# Altium schematic sheet VCU_Schematic.SchDoc
size A3; SheetNumber: 1; SheetTotal: 1
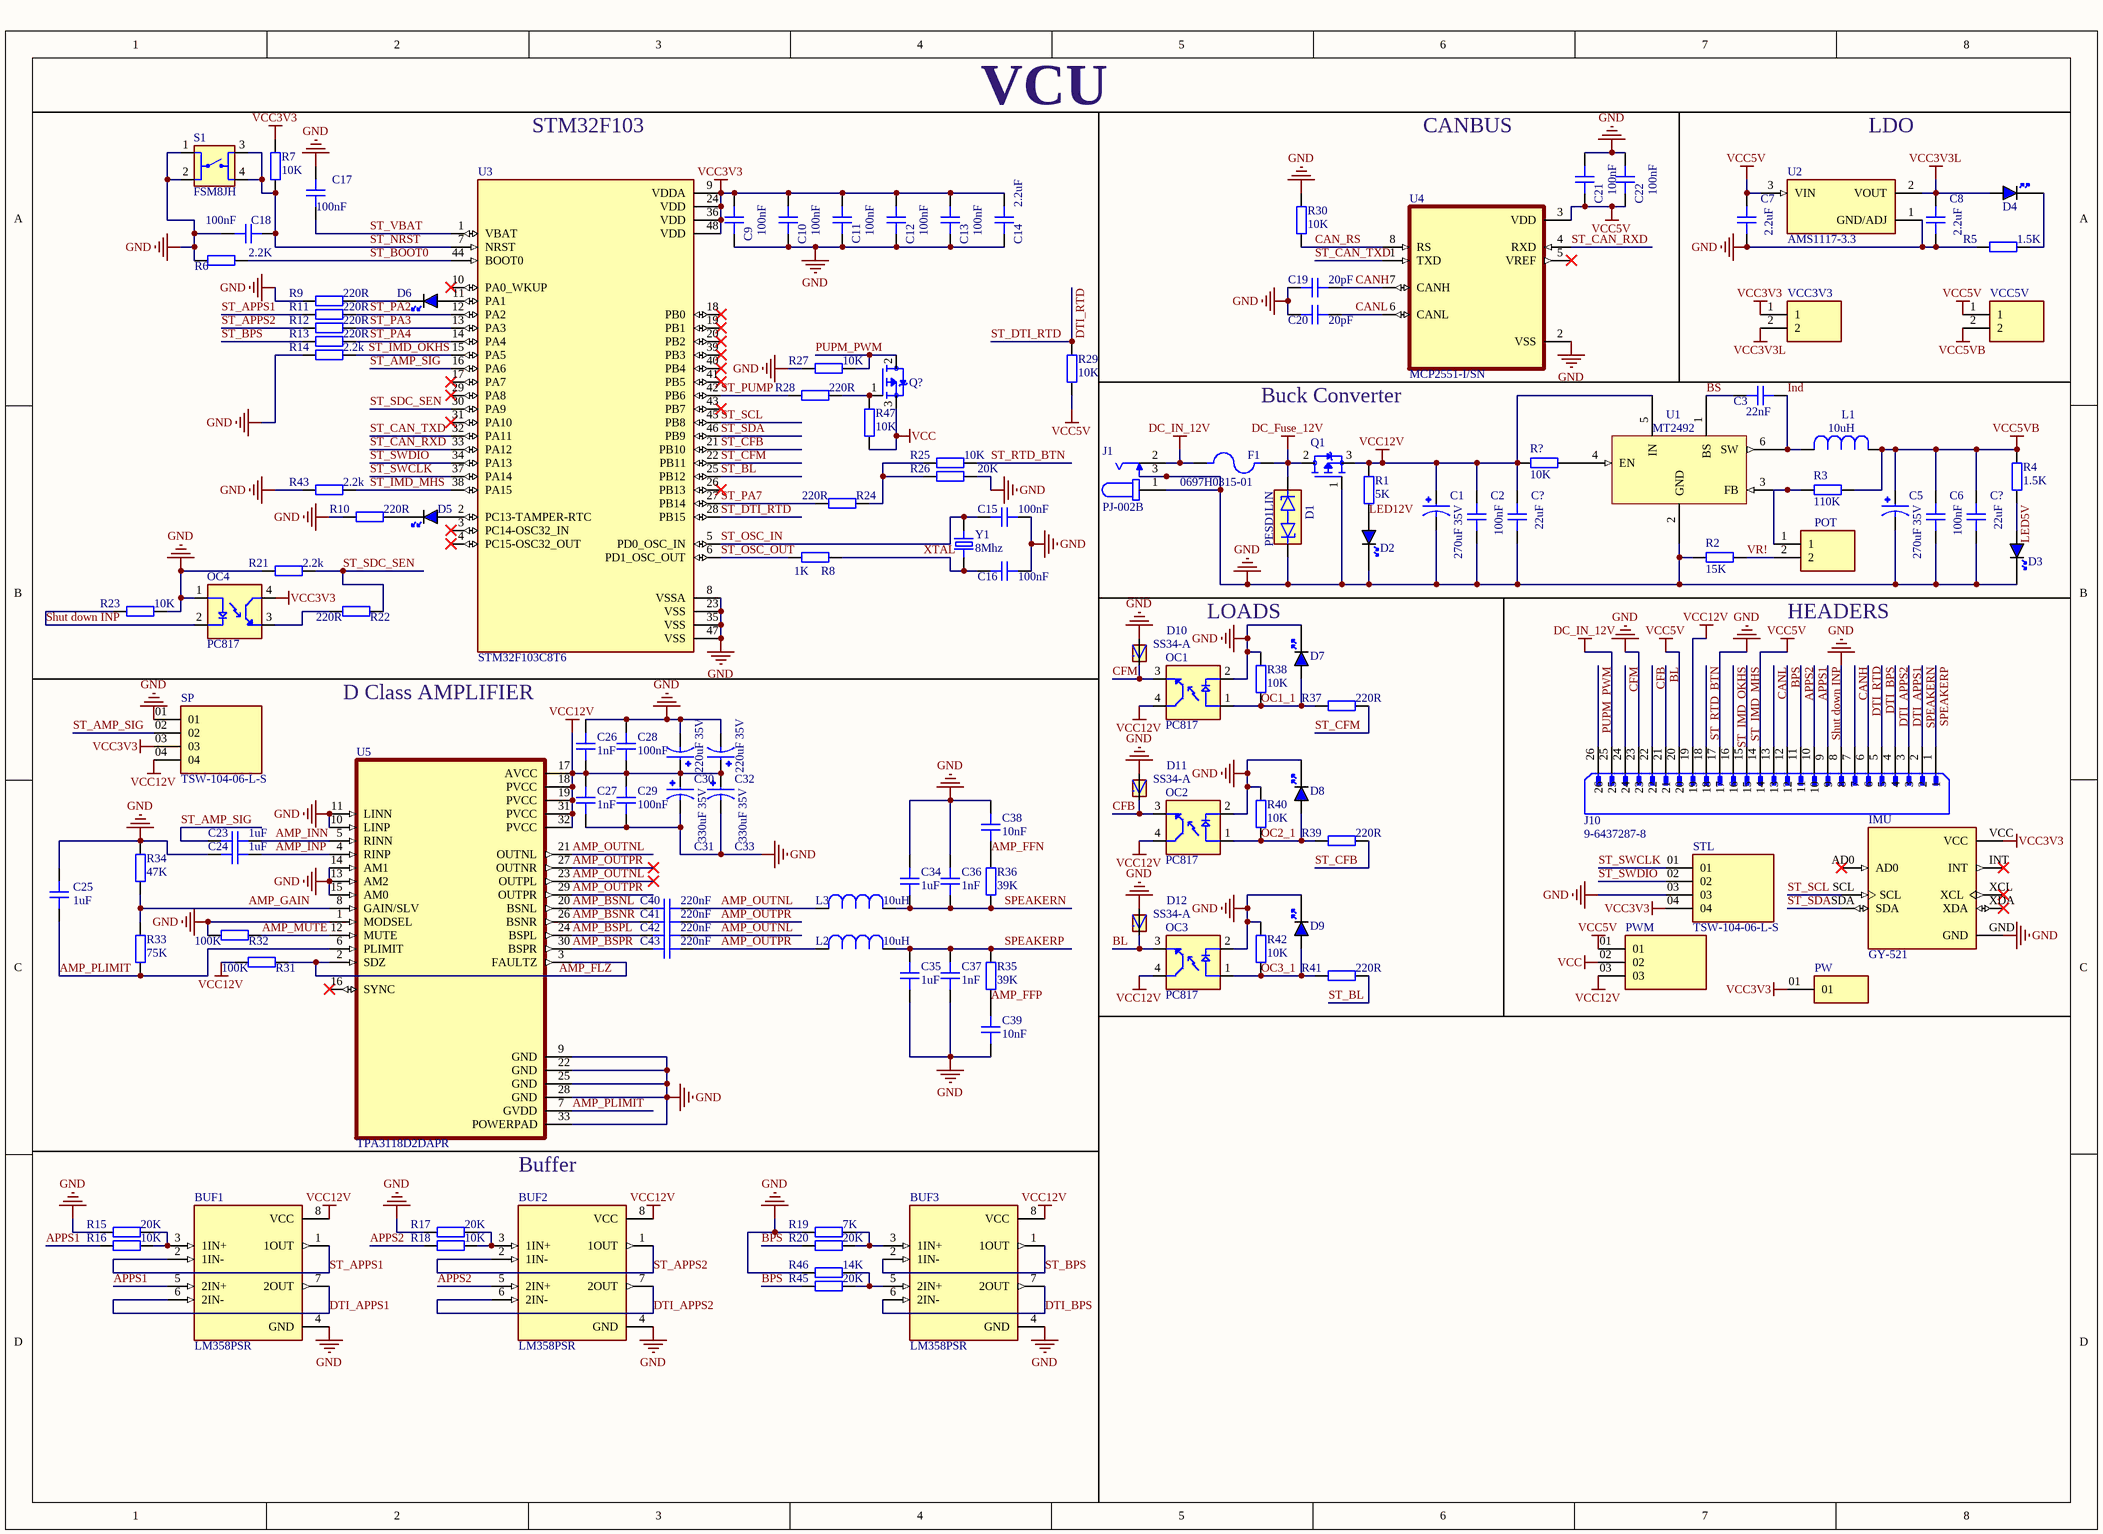
[diagram p0: VCU_Schematic.SchDoc]

## Parts
(Parts that share a designator on the sheet are numbered #1, #2 ... from top to bottom, then left to right.)
BUF1  LM358PSR  [SOIC127P780X200-8N]
BUF2  LM358PSR  [SOIC127P780X200-8N]
BUF3  LM358PSR  [SOIC127P780X200-8N]
C1  270uF 35V  [CAP_EEEFT1E471AP]
C2  100nF  [CAP_0805]
C3  22nF  [CAP_0805]
C5  270uF 35V  [CAP_EEEFT1E471AP]
C6  100nF  [CAP_0805]
C7  2.2uF  [CAP_0805]
C8  2.2uF  [CAP_0805]
C9  100nF  [CAP_0805]
C10  100nF  [CAP_0805]
C11  100nF  [CAP_0805]
C12  100nF  [CAP_0805]
C13  100nF  [CAP_0805]
C14  2.2uF  [CAP_0805]
C15  100nF  [CAP_0805]
C16  100nF  [CAP_0805]
C17  100nF  [CAP_0805]
C18  100nF  [CAP_0805]
C19  20pF  [CAP_0805]
C20  20pF  [CAP_0805]
C21  100nF  [CAP_0805]
C22  100nF  [CAP_0805]
C23  1uF  [CAP_0805]
C24  1uF  [CAP_0805]
C25  1uF  [CAP_0805]
C26  1nF  [CAP_0805]
C27  1nF  [CAP_0805]
C28  100nF  [CAP_0805]
C29  100nF  [CAP_0805]
C30  220uF 35V  [CAP_EEEFT1E471AP]
C31  330uF 35V  [CAP_EEEFT1E471AP]
C32  220uF 35V  [CAP_EEEFT1E471AP]
C33  330uF 35V  [CAP_EEEFT1E471AP]
C34  1uF  [CAP_0805]
C35  1uF  [CAP_0805]
C36  1nF  [CAP_0805]
C37  1nF  [CAP_0805]
C38  10nF  [CAP_0805]
C39  10nF  [CAP_0805]
C40  220nF  [CAP_0805]
C41  220nF  [CAP_0805]
C42  220nF  [CAP_0805]
C43  220nF  [CAP_0805]
C?#1  22uF  [CAP_0805]
C?#2  22uF  [CAP_0805]
D1  PESD1LIN  [DIO_PESD1LIN]
D2  BLUE  [LED_0805_BLUE]  (value not drawn)
D3  BLUE  [LED_0805_BLUE]  (value not drawn)
D4  BLUE  [LED_0805_BLUE]  (value not drawn)
D5  BLUE  [LED_0805_BLUE]  (value not drawn)
D6  BLUE  [LED_0805_BLUE]  (value not drawn)
D7  BLUE  [LED_0805_BLUE]  (value not drawn)
D8  BLUE  [LED_0805_BLUE]  (value not drawn)
D9  BLUE  [LED_0805_BLUE]  (value not drawn)
D10  SS34-A  [DO-214AC]
D11  SS34-A  [DO-214AC]
D12  SS34-A  [DO-214AC]
F1  0697H0315-01  [FUSRR508W60L835T400H810]
IMU  GY-521  [MODULE_GY-521]
J1  PJ-002B  [CUI_PJ-002B]
J10  9-6437287-8  [TE_9-6437287-8]
L1  10uH  [IND_CDRH127/LDNP-470MC_SUM]
L2  10uH  [IND_CDRH127/LDNP-470MC_SUM]
L3  10uH  [IND_CDRH127/LDNP-470MC_SUM]
OC1  PC817  [SOIC254P960X420-4N]
OC2  PC817  [SOIC254P960X420-4N]
OC3  PC817  [SOIC254P960X420-4N]
OC4  PC817  [SOIC254P960X420-4N]
POT  3-644456-2  [TE_3-644456-2]  (value not drawn)
PW  HMTSW-101-X-X-S-X  [SAMTEC_HMTSW-101-X-X-S-X]  (value not drawn)
PWM  TLW-103-05-G-S  [SAMTEC_TLW-103-05-G-S]  (value not drawn)
Q1  IRF4905STRRPBF  [TRANS_IRF4905STRRPBF]  (value not drawn)
Q?  IRF4905STRRPBF  [TRANS_IRF4905STRRPBF]  (value not drawn)
R1  5K  [RES_0805]
R2  15K  [RES_0805]
R3  110K  [RES_0805]
R4  1.5K  [RES_0805]
R5  1.5K  [RES_0805]
R6  2.2K  [RES_0805]
R7  10K  [RES_0805]
R8  1K  [RES_0805]
R9  220R  [RES_0805]
R10  220R  [RES_0805]
R11  220R  [RES_0805]
R12  220R  [RES_0805]
R13  220R  [RES_0805]
R14  2.2k  [RES_0805]
R15  20K  [RES_0805]
R16  10K  [RES_0805]
R17  20K  [RES_0805]
R18  10K  [RES_0805]
R19  7K  [RES_0805]
R20  20K  [RES_0805]
R21  2.2k  [RES_0805]
R22  220R  [RES_0805]
R23  10K  [RES_0805]
R24  220R  [RES_0805]
R25  10K  [RES_0805]
R26  20K  [RES_0805]
R27  10K  [RES_0805]
R28  220R  [RES_0805]
R29  10K  [RES_0805]
R30  10K  [RES_0805]
R31  100K  [RES_0805]
R32  100K  [RES_0805]
R33  75K  [RES_0805]
R34  47K  [RES_0805]
R35  39K  [RES_0805]
R36  39K  [RES_0805]
R37  220R  [RES_0805]
R38  10K  [RES_0805]
R39  220R  [RES_0805]
R40  10K  [RES_0805]
R41  220R  [RES_0805]
R42  10K  [RES_0805]
R43  2.2k  [RES_0805]
R45  20K  [RES_0805]
R46  14K  [RES_0805]
R47  10K  [RES_0805]
R?  10K  [RES_0805]
S1  FSM8JH  [SW_FSM8JH]
SP  TSW-104-06-L-S  [SAMTEC_TSW-104-06-L-S]
STL  TSW-104-06-L-S  [SAMTEC_TSW-104-06-L-S]
U1  MT2492  [PCBComponent_1 - duplicate]
U2  AMS1117-3.3  [SOT229P700X180-4N]
U3  STM32F103C8T6  [QFP50P900X900X160-48N]
U4  MCP2551-I/SN  [SOIC127P599X175-8N]
U5  TPA3118D2DAPR  [SOP65P810X120-33N]
VCC3V3  3-644456-2  [TE_3-644456-2]  (value not drawn)
VCC5V  3-644456-2  [TE_3-644456-2]  (value not drawn)
Y1  8Mhz  [XTAL_ECS-80-20-5PVX]

## Nets
DC_Fuse_12V: D1.2 F1.2 Q1.2(D)
DC_IN_12V: F1.1 J1.2 J10.25
GND: BUF1.4(GND) BUF2.4(GND) BUF3.4(GND) C1.2 C2.2 C5.2 C6.2 C7.2 C8.2 C9.1 C10.1 C11.1 C12.1 C13.1 C14.2 C15.1 C16.1 C17.1 C18.2 C19.2 C20.2 C21.2 C22.2 C24.1 C25.2 C26.2 C27.1 C28.2 C29.1 C30.2 C31.2 C32.2 C33.2 C34.2 C35.2 C36.2 C37.2 C38.2 C39.2 C?#1.2 C?#2.2 D1.1 D2.K D3.K D7.K D8.K D9.K D10.A D11.A D12.A IMU.GND J1.1 J1.3 J10.8 J10.17 J10.23 OC1.2(C) OC2.2(C) OC3.2(C) OC4.1(A) Q1.1(G) R2.1 R5.2 R6.1 R9.2 R10.2 R14.2 R15.2 R17.2 R19.2 R21.2 R23.2 R26.2 R27.1 R30.2 R32.1 R34.2 R38.2 R40.2 R42.2 R43.2 R46.2 S1.1 S1.2 SP.01 STL.03 U1.2(GND) U2.1(GND/ADJ) U3.8(VSSA) U3.23(VSS) U3.35(VSS) U3.47(VSS) U4.2(VSS) U5.1(MODSEL) U5.9(GND) U5.10(LINP) U5.11(LINN) U5.13(AM2) U5.14(AM1) U5.15(AM0) U5.22(GND) U5.25(GND) U5.28(GND) U5.33(POWERPAD)
VCC: PWM.02 Q?.3(S) R47.2
VCC3V3: C9.2 C10.2 C11.2 C12.2 C13.2 C14.1 IMU.VCC OC4.4(CT) PW.01 R7.2 SP.03 STL.04 U3.9(VDDA) U3.24(VDD) U3.36(VDD) U3.48(VDD) VCC3V3.1
VCC3V3L: C8.1 D4.A U2.2(VOUT) VCC3V3.2
VCC5V: C7.1 C21.1 C22.1 J10.14 J10.20 PWM.01 R29.2 U2.3(VIN) U4.3(VDD) VCC5V.1
VCC5VB: C5.1 C6.1 C?#2.1 L1.1 R3.2 R4.2 VCC5V.2
VCC12V: BUF1.8(VCC) BUF2.8(VCC) BUF3.8(VCC) C1.1 C2.1 C26.1 C27.2 C28.1 C29.2 C30.1 C31.1 C32.1 C33.1 C?#1.1 J10.19 OC1.4(CT) OC2.4(CT) OC3.4(CT) PWM.03 Q1.3(S) R1.2 R31.1 R?.2 SP.04 U1.5(IN) U5.17(AVCC) U5.18(PVCC) U5.19(PVCC) U5.31(PVCC) U5.32(PVCC)
AMP_BSNL: C40.2 U5.20(BSNL)
AMP_BSNR: C41.2 U5.26(BSNR)
AMP_BSPL: C42.2 U5.24(BSPL)
AMP_BSPR: C43.2 U5.30(BSPR)
AMP_FFN: C38.1 R36.2
AMP_FFP: C39.1 R35.2
AMP_FLZ: R31.2 U5.2(SDZ) U5.3(FAULTZ)
AMP_GAIN: R33.2 R34.1 U5.8(GAIN/SLV)
AMP_INN: C23.2 U5.5(RINN)
AMP_INP: C24.2 U5.4(RINP)
AMP_MUTE: R32.2 U5.12(MUTE)
AMP_OUTNL: C40.1 C42.1 L3.2 U5.21(OUTNL) U5.23(OUTPL)
AMP_OUTPR: C41.1 C43.1 L2.2 U5.27(OUTNR) U5.29(OUTPR)
AMP_PLIMIT: C25.1 R33.1 U5.6(PLIMIT) U5.7(GVDD)
APPS1: BUF1.5(2IN+) J10.10 R16.2
APPS2: BUF2.5(2IN+) J10.11 R18.2
BL: D12.C J10.21 OC3.3(ET)
BPS: J10.12 R20.2 R45.2
BS: C3.1 U1.1(BS)
CAN_RS: R30.1 U4.8(RS)
CANH: C19.1 J10.7 U4.7(CANH)
CANL: C20.1 J10.13 U4.6(CANL)
CFB: D11.C J10.22 OC2.3(ET)
CFM: D10.C J10.24 OC1.3(ET)
DTI_APPS1: BUF1.6(2IN-) BUF1.7(2OUT) J10.3
DTI_APPS2: BUF2.6(2IN-) BUF2.7(2OUT) J10.4
DTI_BPS: BUF3.6(2IN-) BUF3.7(2OUT) J10.5
DTI_RTD: J10.6 R29.1 U3.28(PB15)  [also labelled ST_DTI_RTD]
Ind: C3.2 L1.2 U1.6(SW)
LED5V: D3.A R4.1
LED12V: D2.A R1.1
OC1_1: D7.A OC1.1(A) R37.2 R38.1
OC2_1: D8.A OC2.1(A) R39.2 R40.1
OC3_1: D9.A OC3.1(A) R41.2 R42.1
PUPM_PWM: J10.26 Q?.2(D) R27.2
Shut down INP: J10.9 OC4.2(C) R23.1
SPEAKERN: C34.1 C36.1 J10.2 L3.1 R36.1
SPEAKERP: C35.1 C37.1 J10.1 L2.1 R35.1
ST_AMP_SIG: C23.1 SP.02 U3.16(PA6)
ST_APPS1: BUF1.1(1OUT) BUF1.2(1IN-) R11.2
ST_APPS2: BUF2.1(1OUT) BUF2.2(1IN-) R12.2
ST_BL: R41.1 U3.25(PB12)
ST_BOOT0: R6.2 U3.44(BOOT0)
ST_BPS: BUF3.1(1OUT) BUF3.2(1IN-) R13.2
ST_CAN_RXD: U3.33(PA12) U4.4(RXD)
ST_CAN_TXD: U3.32(PA11) U4.1(TXD)
ST_CFB: R39.1 U3.21(PB10)
ST_CFM: R37.1 U3.22(PB11)
ST_IMD_MHS: J10.15 R43.1 U3.38(PA15)
ST_IMD_OKHS: J10.16 R14.1 U3.15(PA5)
ST_NRST: C18.1 R7.1 S1.3 S1.4 U3.7(NRST)
ST_OSC_IN: C15.2 U3.5(PD0_OSC_IN) Y1.2
ST_OSC_OUT: R8.1 U3.6(PD1_OSC_OUT)
ST_PA2: R11.1 U3.12(PA2)
ST_PA3: R12.1 U3.13(PA3)
ST_PA4: R13.1 U3.14(PA4)
ST_PA7: R24.1 U3.27(PB14)
ST_PUMP: R28.1 U3.42(PB6)
ST_RTD_BTN: J10.18 R25.2
ST_SCL: IMU.SCL U3.45(PB8)
ST_SDA: IMU.SDA U3.46(PB9)
ST_SDC_SEN: R21.1 R22.2 U3.30(PA9)
ST_SWCLK: STL.01 U3.37(PA14)
ST_SWDIO: STL.02 U3.34(PA13)
ST_VBAT: C17.2 U3.1(VBAT)
VR!: POT.2 R2.2
XTAL: C16.2 R8.2 Y1.1
NetBUF1_3: BUF1.3(1IN+) R15.1 R16.1
NetBUF2_3: BUF2.3(1IN+) R17.1 R18.1
NetBUF3_3: BUF3.3(1IN+) R19.1 R20.1
NetBUF3_5: BUF3.5(2IN+) R45.1 R46.1
NetD4_K: D4.K R5.1
NetD5_A: D5.A U3.2(PC13-TAMPER-RTC)
NetD5_K: D5.K R10.1
NetD6_A: D6.A U3.11(PA1)
NetD6_K: D6.K R9.1
NetOC4_3: OC4.3(ET) R22.1
NetPOT_1: POT.1 R3.1 U1.3(FB)
NetQ?_1: Q?.1(G) R28.2 R47.1
NetR24_2: R24.2 R25.1 R26.1
NetR?_1: R?.1 U1.4(EN)

Not connected (* = marked no-connect by the designer): IMU AD0* INT* XCL* XDA*; U3 3(PC14-OSC32_IN)* 4(PC15-OSC32_OUT)* 10(PA0_WKUP)* 17(PA7)* 18(PB0)* 19(PB1)* 20(PB2)* 26(PB13)* 29(PA8)* 31(PA10)* 39(PB3)* 40(PB4)* 41(PB5)* 43(PB7)*; U4 5(VREF)*; U5 16(SYNC)*

## Notes on the sheet
- STM32F103
- VCU
- CANBUS
- LDO
- Buck Converter
- LOADS
- (near POT) HEADERS
- D Class AMPLIFIER
- Buffer

## Library data of the parts
BUF1-BUF3 = LM358PSR: Dual, 30-V, 700-kHz operational amplifier; MF: Texas Instruments; SnapEDA_Link: https://www.snapeda.com/parts/LM358PSR/Texas+Instruments/view-part/?ref=snap; Package: SOP-8 Texas Instruments; Value: *; MP: LM358PSR; Check_prices: https://www.snapeda.com/parts/LM358PSR/Texas+Instruments/view-part/?ref=eda
C1 C5 C30-C33 = EEEFT1E471AP: Cap Aluminum Lytic 470uF 25V 20% (8 X 10.2mm) SMD 0.08 Ohm 850mA 2000h 105C Automotive T/R; MF: Panasonic; SnapEDA_Link: https://www.snapeda.com/parts/EEEFT1E471AP/Panasonic/view-part/?ref=snap; Package: RADIAL-2 Panasonic; Value: *; MP: EEEFT1E471AP; Check_prices: https://www.snapeda.com/parts/EEEFT1E471AP/Panasonic/view-part/?ref=eda
C2 C3 C6-C29 C34-C43 C?#1 C?#2 = CAP_0805: Capacitor SMD 0805; Manufacturer: *; Manufacturer Part Number: *; Distributor Link: *; LCSC: *; Rating: *; Dielectric: *
D1 = PESD1LIN: 44V, 70V Clamp 3A (8/20Âµs) Ipp Tvs Diode Surface Mount SOD-323; MF: Nexperia USA; SnapEDA_Link: https://www.snapeda.com/parts/PESD1LIN/Nexperia/view-part/?ref=snap; Package: SOD-323 Vishay Semiconductor Diodes Division; Value: *; MP: PESD1LIN; Check_prices: https://www.snapeda.com/parts/PESD1LIN/Nexperia/view-part/?ref=eda
D2-D9 = LED_0805_BLUE: LED 0805 BLUE SMD; Manufacturer: *; Manufacturer Part Number: *; Distributor Link: *; LCSC: *
D10-D12 = SS34-A: Schottky barrier diode, 3A, 40V; MF: hy electronic corp; MP: SS34A; SnapEDA_Link: https://www.snapeda.com/parts/SS34A/HY+Electronic/view-part/?ref=snap; Package: None; Value: *; Check_prices: https://www.snapeda.com/parts/SS34A/HY+Electronic/view-part/?ref=eda
F1 = 0697H0315-01: 2-Pin Radial Fuse | Rectangular | Slow Blow | UL | 315mA; MF: Bel Fuse; SnapEDA_Link: https://www.snapeda.com/parts/0697H0315-01/Bel+Circuit+Protection/view-part/?ref=snap; Package: Radial Box  Bel Fuse; Value: *; MP: 0697H0315-01; Check_prices: https://www.snapeda.com/parts/0697H0315-01/Bel+Circuit+Protection/view-part/?ref=eda
IMU = GY-521: Triple Axis Accelerometer Gyro Breakout; MF: GODREAM FORDREAM CO., LIMITED; SnapEDA_Link: https://www.snapeda.com/parts/GY-521/GODREAM+FORDREAM+CO.%252C+LIMITED/view-part/?ref=snap; Package: Package; Value: *; MP: GY-521; Check_prices: https://www.snapeda.com/parts/GY-521/GODREAM+FORDREAM+CO.%252C+LIMITED/view-part/?ref=eda
J1 = PJ-002B: 2.5 x 6.5 mm, 2.5 A, Horizontal, Through Hole, Dc Power Jack Connector; MF: Same Sky; SnapEDA_Link: https://www.snapeda.com/parts/PJ-002B/Same+Sky/view-part/?ref=snap; Package: None; Value: *; MP: PJ-002B; Check_prices: https://www.snapeda.com/parts/PJ-002B/Same+Sky/view-part/?ref=eda
J10 = 9-6437287-8: MF: {'manufacturer': 'TE Connectivity'}; Package: None; Value: *; Availability: Unavailable; MP: 9-6437287-8; Price: None
L1-L3 = CDRH127/LDNP-470MC: Inductor Power Shielded Drum Core 47uH 20% 1KHz Ferrite 4.1A 0.078Ohm DCR T/R; MF: Sumida Corporation; SnapEDA_Link: https://www.snapeda.com/parts/CDRH127/LDNP-470MC/Sumida/view-part/?ref=snap; Package: Non Standard Sumida; Value: *; MP: CDRH127/LDNP-470MC; Check_prices: https://www.snapeda.com/parts/CDRH127/LDNP-470MC/Sumida/view-part/?ref=eda
OC1-OC4 = PC817X1NIP1B: Optoisolator Transistor Output 1 Channel 4-SMD; MF: Sharp Microelectronics; SnapEDA_Link: https://www.snapeda.com/parts/PC817X1NIP1B/Sharp+Microelectronics/view-part/?ref=snap; Package: None; Value: *; MP: PC817X1NIP1B; Check_prices: https://www.snapeda.com/parts/PC817X1NIP1B/Sharp+Microelectronics/view-part/?ref=eda
POT VCC3V3 VCC5V = 3-644456-2: HEADER ASSEMBLY, NARROW, MTA-100, 2 POSITION, STRAIGHT | TE Connectivity 3-644456-2; SnapEDA_Link: https://www.snapeda.com/parts/3-644456-2/TE+Connectivity+AMP+Connectors/view-part/?ref=snap; Package: None; Value: *; MF: TE Connectivity; MP: 3-644456-2; Check_prices: https://www.snapeda.com/parts/3-644456-2/TE+Connectivity+AMP+Connectors/view-part/?ref=eda
PW = HMTSW-101-X-X-S-X: CONN HEADER VERT 1POS; MF: Samtec; MP: HMTSW-101-07-G-S-230; SnapEDA_Link: https://www.snapeda.com/parts/HMTSW-101-07-G-S-230/Samtec/view-part/?ref=snap; Package: None; Value: *; Check_prices: https://www.snapeda.com/parts/HMTSW-101-07-G-S-230/Samtec/view-part/?ref=eda
Q1 Q? = IRF4905STRRPBF: RoHS Compliant | Low RDS(on) | Industry-leading quality | Dynamic dv/dt Rating | Fast Switching | Fully Avalanche Rated | 175C Operating Temperature | P-Channel MOSFET; MF: Infineon Technologies; Package: D2PAK Infineon; Price: None; Availability: In Stock; Purchase-URL: https://pricing.snapeda.com/search/part/IRF4905STRRPBF/?ref=eda; Check_prices: https://www.snapeda.com/parts/IRF4905STRRPBF/Infineon+Technologies/view-part/?ref=eda; MP: IRF4905STRRPBF; SnapEDA_Link: https://www.snapeda.com/parts/IRF4905STRRPBF/Infineon+Technologies/view-part/?ref=snap; Value: *
R1-R43 R45-R47 R? = RES_0805: Resistor SMD 0805; Manufacturer: *; Manufacturer Part Number: *; Distributor Link: *; LCSC: *
S1 = FSM8JH: Tactile Switch SPST-NO Top Actuated Through Hole; MF: TE Connectivity; Check_prices: https://www.snapeda.com/parts/FSM8JH/TE+Connectivity+ALCOSWITCH+Switches/view-part/?ref=eda; Value: *; Availability: In Stock; MP: FSM8JH; Price: None; Package: None; SnapEDA_Link: https://www.snapeda.com/parts/FSM8JH/TE+Connectivity+ALCOSWITCH+Switches/view-part/?ref=snap
U1 = MT2492: DC-DC step-down converter (buck converter)
U2 = AMS1117-3.3: Sot223/Pkg 1-Amp 3.3-Volt Low Drop Out Voltage Regulatator; MF: Advanced Monolithic Systems; SnapEDA_Link: https://www.snapeda.com/parts/AMS1117-3.3/Advanced+Monolithic+Systems/view-part/?ref=snap; Package: SOT-223 Seeed Technology; Value: *; MP: AMS1117-3.3; Check_prices: https://www.snapeda.com/parts/AMS1117-3.3/Advanced+Monolithic+Systems/view-part/?ref=eda
U3 = STM32F103C8T6: ARM® Cortex®-M3 STM32F1 Microcontroller IC 32-Bit 72MHz 64KB (64K x 8) FLASH 48-LQFP (7x7); MF: STMicroelectronics; SnapEDA_Link: https://www.snapeda.com/parts/STM32F103C8T6/STMicroelectronics/view-part/?ref=snap; Package: LQFP-48 STMicroelectronics; Value: *; MP: STM32F103C8T6; Check_prices: https://www.snapeda.com/parts/STM32F103C8T6/STMicroelectronics/view-part/?ref=eda
U5 = TPA3118D2DAPR: 30-W stereo, 60-W mono, 4.5- to 26-V supply, analog input Class-D audio amplifier; MF: Texas Instruments; SnapEDA_Link: https://www.snapeda.com/parts/TPA3118D2DAPR/Texas+Instruments/view-part/?ref=snap; Package: HTSSOP-32 Texas Instruments; Value: *; MP: TPA3118D2DAPR; Check_prices: https://www.snapeda.com/parts/TPA3118D2DAPR/Texas+Instruments/view-part/?ref=eda
Y1 = ECS-80-20-5PVX: SMD Quartz crystal; Package: None; Price: None; Value: *; MP: ECS-80-20-5PVX; Availability: Unavailable
PWM = TLW-103-05-G-S: Value: *; MP: TLW-103-05-G-S; Package: None; Availability: Unavailable; Price: None
SP STL = TSW-104-06-L-S: Package: None; Price: None; Value: *; MP: TSW-104-06-L-S; Availability: Unavailable
U4 = MCP2551-I/SN: Package: None; MP: MCP2551-I/SN; Price: None; Availability: Unavailable; Value: *